# Altium project PCIE_X4_X16_ADP_V1.PrjPcb
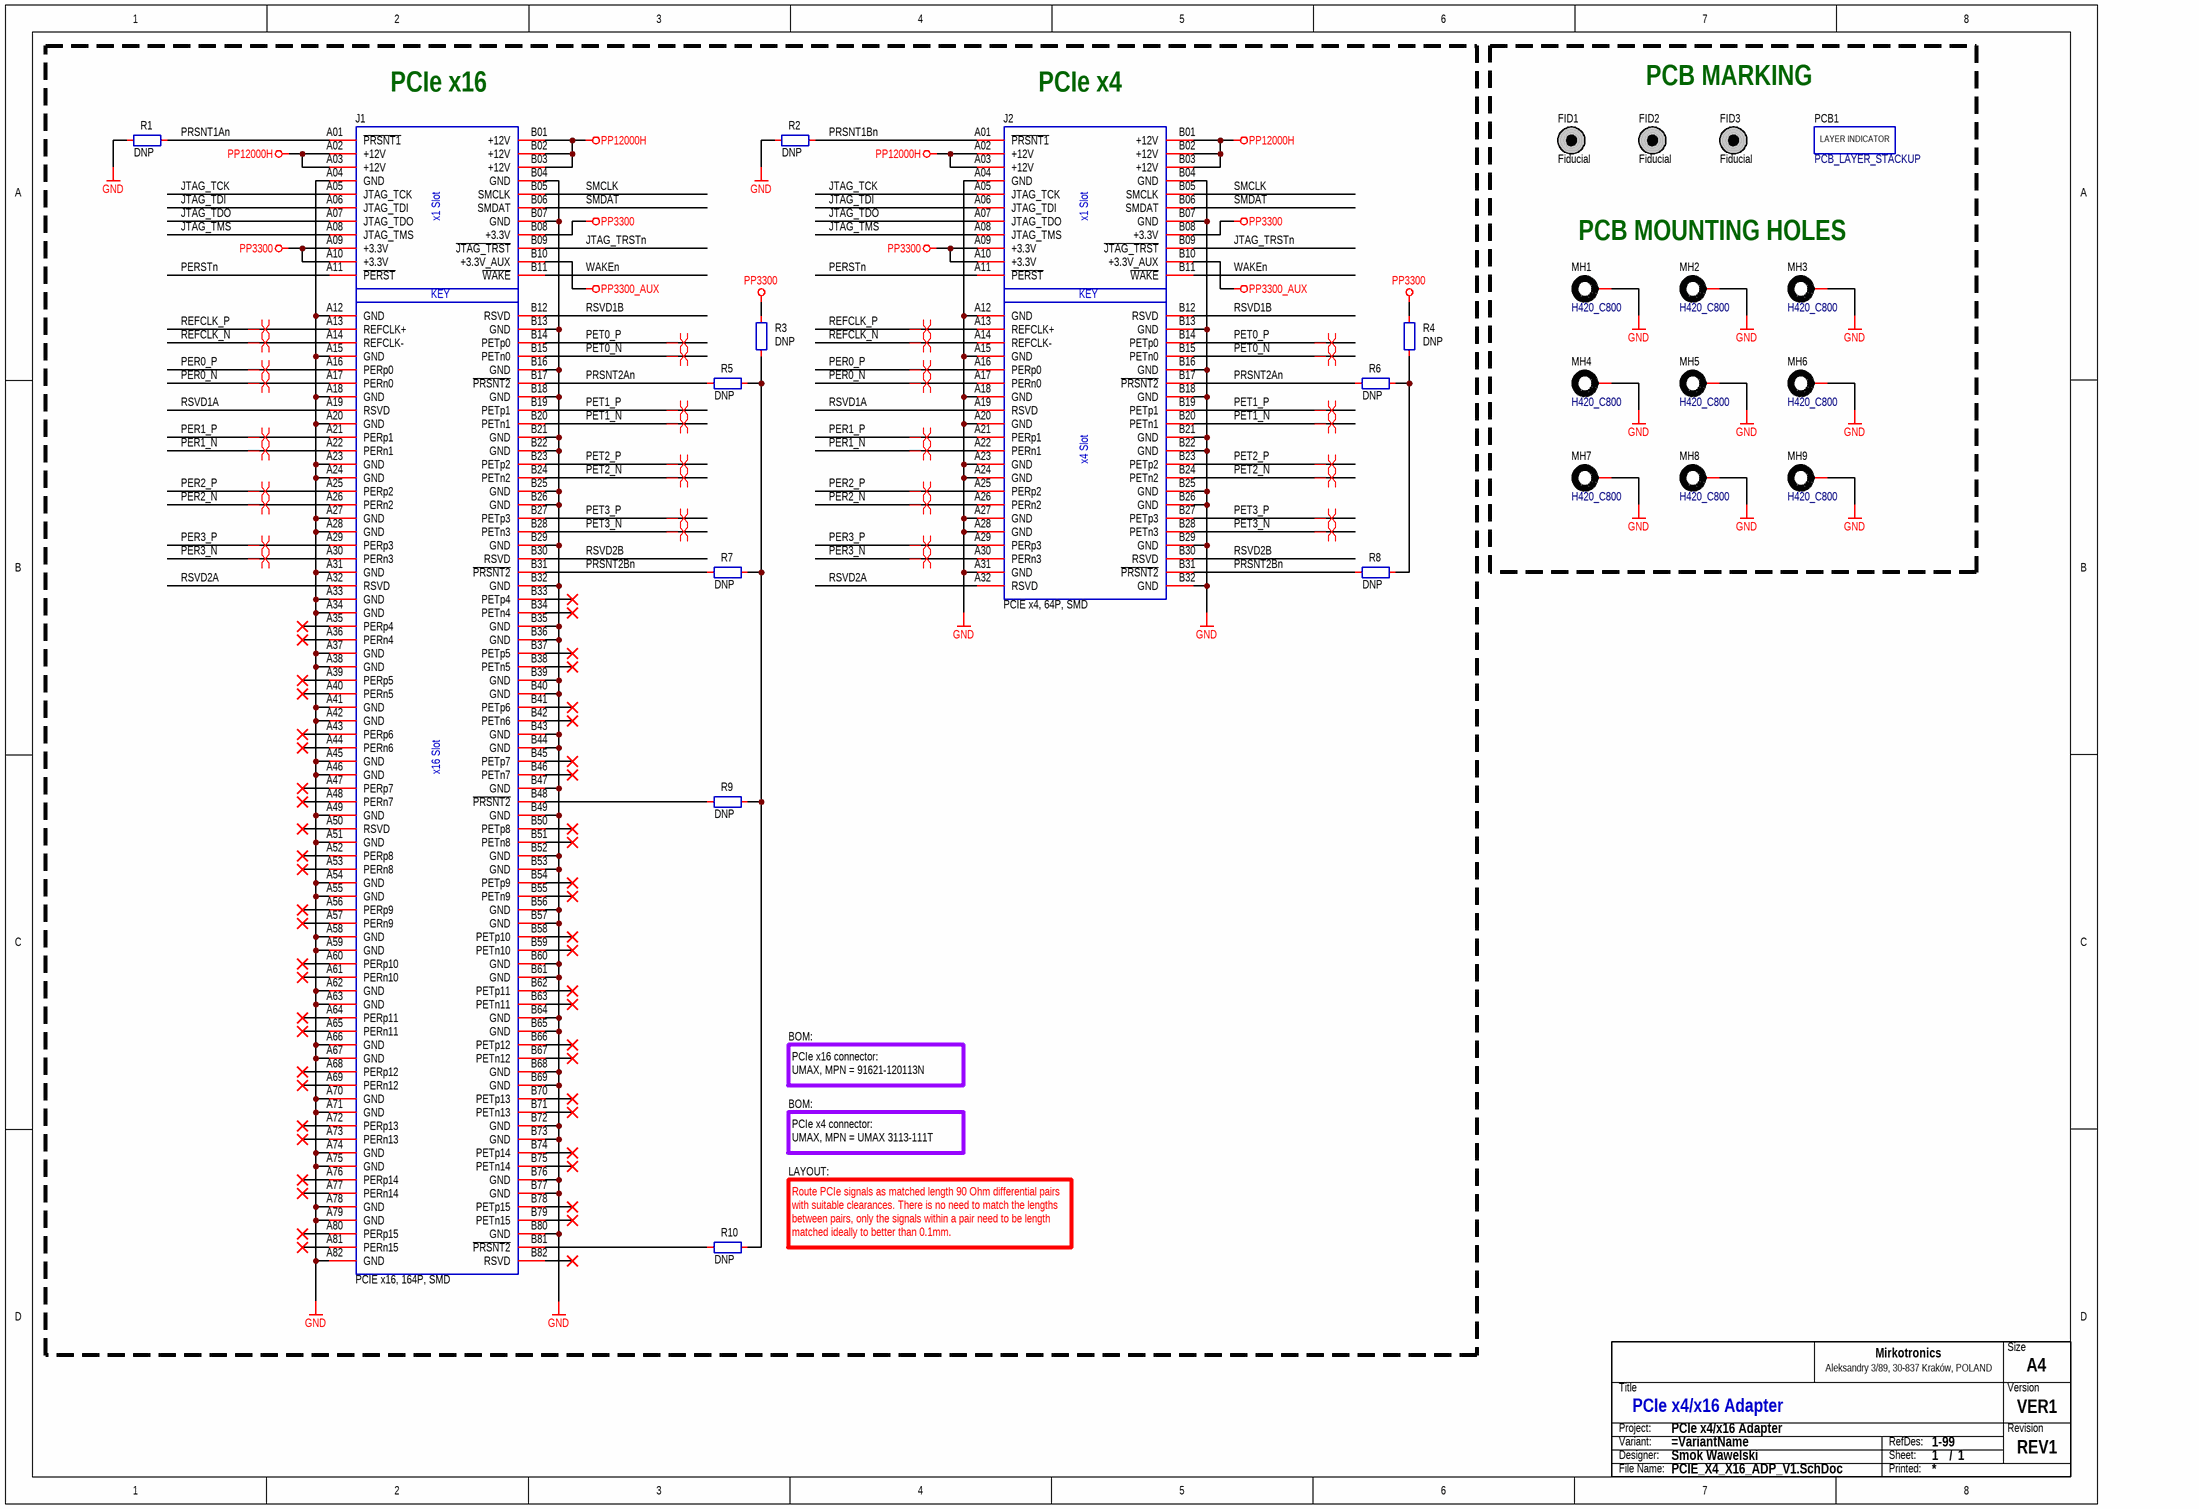
[diagram p0: PCIE_X4_X16_ADP_V1.SchDoc]
GlobalProjectName: PCIe x4/x16 Adapter; PCBProjectName: PCIe x4/x16 Adapter; SchPcbReleaseState: DRAFT; SchPcbRevision: REV1; SchPcbVersion: VER1
1 sheet, 26 parts. Net scope: global (net labels, ports and power ports of the same name join across sheets).
Board file: PCIE_X4_X16_ADP_V1.PcbDoc

## Sheet PCIE_X4_X16_ADP_V1.SchDoc: PCIe x4/x16 Adapter
size A3; Engineer: Smok Wawelski; DocumentNumber: 10; SheetNumber: 1; SheetTotal: 1; PageSize: A4; Designators: 1-99

### Parts
FID1  Fiducial  [PCB_FID_RND_100x300]  (no BOM)
FID2  Fiducial  [PCB_FID_RND_100x300]  (no BOM)
FID3  Fiducial  [PCB_FID_RND_100x300]  (no BOM)
J1  PCIE x16, 164P, SMD  [CON_UMX_91621-120113N]
J2  PCIE x4, 64P, SMD  [CON_UMX_91611-11011T]
MH1  H420_C800  [PCB_MH_H420_C800]  (no BOM)
MH2  H420_C800  [PCB_MH_H420_C800]  (no BOM)
MH3  H420_C800  [PCB_MH_H420_C800]  (no BOM)
MH4  H420_C800  [PCB_MH_H420_C800]  (no BOM)
MH5  H420_C800  [PCB_MH_H420_C800]  (no BOM)
MH6  H420_C800  [PCB_MH_H420_C800]  (no BOM)
MH7  H420_C800  [PCB_MH_H420_C800]  (no BOM)
MH8  H420_C800  [PCB_MH_H420_C800]  (no BOM)
MH9  H420_C800  [PCB_MH_H420_C800]  (no BOM)
PCB1  PCB_LAYER_STACKUP  [PCB_STACKUP-4L]  (no BOM)
R1  DNP  [RES_0603_R]
R2  DNP  [RES_0603_R]
R3  DNP  [RES_0603_R]
R4  DNP  [RES_0603_R]
R5  DNP  [RES_0603_R]
R6  DNP  [RES_0603_R]
R7  DNP  [RES_0603_R]
R8  DNP  [RES_0603_R]
R9  DNP  [RES_0603_R]
R10  DNP  [RES_0603_R]
TB?  Title block  (value not drawn)  (graphical)

### Nets
GND: J1.A04(GND) J1.A12(GND) J1.A15(GND) J1.A18(GND) J1.A20(GND) J1.A23(GND) J1.A24(GND) J1.A27(GND) J1.A28(GND) J1.A31(GND) J1.A33(GND) J1.A34(GND) J1.A37(GND) J1.A38(GND) J1.A41(GND) J1.A42(GND) J1.A45(GND) J1.A46(GND) J1.A49(GND) J1.A51(GND) J1.A54(GND) J1.A55(GND) J1.A58(GND) J1.A59(GND) J1.A62(GND) J1.A63(GND) J1.A66(GND) J1.A67(GND) J1.A70(GND) J1.A71(GND) J1.A74(GND) J1.A75(GND) J1.A78(GND) J1.A79(GND) J1.A82(GND) J1.B04(GND) J1.B07(GND) J1.B13(GND) J1.B16(GND) J1.B18(GND) J1.B21(GND) J1.B22(GND) J1.B25(GND) J1.B26(GND) J1.B29(GND) J1.B32(GND) J1.B35(GND) J1.B36(GND) J1.B39(GND) J1.B40(GND) J1.B43(GND) J1.B44(GND) J1.B47(GND) J1.B49(GND) J1.B52(GND) J1.B53(GND) J1.B56(GND) J1.B57(GND) J1.B60(GND) J1.B61(GND) J1.B64(GND) J1.B65(GND) J1.B68(GND) J1.B69(GND) J1.B72(GND) J1.B73(GND) J1.B76(GND) J1.B77(GND) J1.B80(GND) J2.A04(GND) J2.A12(GND) J2.A15(GND) J2.A18(GND) J2.A20(GND) J2.A23(GND) J2.A24(GND) J2.A27(GND) J2.A28(GND) J2.A31(GND) J2.B04(GND) J2.B07(GND) J2.B13(GND) J2.B16(GND) J2.B18(GND) J2.B21(GND) J2.B22(GND) J2.B25(GND) J2.B26(GND) J2.B29(GND) J2.B32(GND) MH1.MH MH2.MH MH3.MH MH4.MH MH5.MH MH6.MH MH7.MH MH8.MH MH9.MH R1.1 R2.1
PP3300: J1.A09(+3.3V) J1.A10(+3.3V) J1.B08(+3.3V) J2.A09(+3.3V) J2.A10(+3.3V) J2.B08(+3.3V) R3.2 R4.2
PP3300_AUX: J1.B10(+3.3V_AUX) J2.B10(+3.3V_AUX)
PP12000H: J1.A02(+12V) J1.A03(+12V) J1.B01(+12V) J1.B02(+12V) J1.B03(+12V) J2.A02(+12V) J2.A03(+12V) J2.B01(+12V) J2.B02(+12V) J2.B03(+12V)
JTAG_TCK: J1.A05(JTAG_TCK) J2.A05(JTAG_TCK)
JTAG_TDI: J1.A06(JTAG_TDI) J2.A06(JTAG_TDI)
JTAG_TDO: J1.A07(JTAG_TDO) J2.A07(JTAG_TDO)
JTAG_TMS: J1.A08(JTAG_TMS) J2.A08(JTAG_TMS)
JTAG_TRSTn: J1.B09(~{JTAG_T}~{RST}) J2.B09(~{JTAG_T}~{RST})
PER0_N: J1.A17(PERn0) J2.A17(PERn0)
PER0_P: J1.A16(PERp0) J2.A16(PERp0)
PER1_N: J1.A22(PERn1) J2.A22(PERn1)
PER1_P: J1.A21(PERp1) J2.A21(PERp1)
PER2_N: J1.A26(PERn2) J2.A26(PERn2)
PER2_P: J1.A25(PERp2) J2.A25(PERp2)
PER3_N: J1.A30(PERn3) J2.A30(PERn3)
PER3_P: J1.A29(PERp3) J2.A29(PERp3)
PERSTn: J1.A11(~{PERST}) J2.A11(~{PERST})
PET0_N: J1.B15(PETn0) J2.B15(PETn0)
PET0_P: J1.B14(PETp0) J2.B14(PETp0)
PET1_N: J1.B20(PETn1) J2.B20(PETn1)
PET1_P: J1.B19(PETp1) J2.B19(PETp1)
PET2_N: J1.B24(PETn2) J2.B24(PETn2)
PET2_P: J1.B23(PETp2) J2.B23(PETp2)
PET3_N: J1.B28(PETn3) J2.B28(PETn3)
PET3_P: J1.B27(PETp3) J2.B27(PETp3)
PRSNT1An: J1.A01(~{PRSNT1}) R1.2
PRSNT1Bn: J2.A01(~{PRSNT1}) R2.2
PRSNT2An: J1.B17(~{PRSNT2}) J2.B17(~{PRSNT2}) R5.1 R6.1
PRSNT2Bn: J1.B31(~{PRSNT2}) J2.B31(~{PRSNT2}) R7.1 R8.1
REFCLK_N: J1.A14(REFCLK-) J2.A14(REFCLK-)
REFCLK_P: J1.A13(REFCLK+) J2.A13(REFCLK+)
RSVD1A: J1.A19(RSVD) J2.A19(RSVD)
RSVD1B: J1.B12(RSVD) J2.B12(RSVD)
RSVD2A: J1.A32(RSVD) J2.A32(RSVD)
RSVD2B: J1.B30(RSVD) J2.B30(RSVD)
SMCLK: J1.B05(SMCLK) J2.B05(SMCLK)
SMDAT: J1.B06(SMDAT) J2.B06(SMDAT)
WAKEn: J1.B11(~{WAKE}) J2.B11(~{WAKE})
NetJ1_B48: J1.B48(~{PRSNT2}) R9.1
NetJ1_B81: J1.B81(~{PRSNT2}) R10.1
NetR3_1: R3.1 R5.2 R7.2 R9.2 R10.2
NetR4_1: R4.1 R6.2 R8.2

Not connected (* = marked no-connect by the designer): J1 A35(PERp4)* A36(PERn4)* A39(PERp5)* A40(PERn5)* A43(PERp6)* A44(PERn6)* A47(PERp7)* A48(PERn7)* A50(RSVD)* A52(PERp8)* A53(PERn8)* A56(PERp9)* A57(PERn9)* A60(PERp10)* A61(PERn10)* A64(PERp11)* A65(PERn11)* A68(PERp12)* A69(PERn12)* A72(PERp13)* A73(PERn13)* A76(PERp14)* A77(PERn14)* A80(PERp15)* A81(PERn15)* B33(PETp4)* B34(PETn4)* B37(PETp5)* B38(PETn5)* B41(PETp6)* B42(PETn6)* B45(PETp7)* B46(PETn7)* B50(PETp8)* B51(PETn8)* B54(PETp9)* B55(PETn9)* B58(PETp10)* B59(PETn10)* B62(PETp11)* B63(PETn11)* B66(PETp12)* B67(PETn12)* B70(PETp13)* B71(PETn13)* B74(PETp14)* B75(PETn14)* B78(PETp15)* B79(PETn15)* B82(RSVD)*

### Layout directives
differential pair: PER0_N, PER0_P, PER1_N, PER1_P, PER2_N, PER2_P, PER3_N, PER3_P, PET0_N, PET0_P, PET1_N, PET1_P, PET2_N, PET2_P, PET3_N, PET3_P, REFCLK_N, REFCLK_P

### Notes on the sheet
- (near J1) PCIe x16
- (near J2) PCIe x4
- PCB MARKING
- PCB MOUNTING HOLES
- BOM:
- PCIe x16 connector:
  UMAX, MPN = 91621-120113N
- LAYOUT:
- PCIe x4 connector:
  UMAX, MPN = UMAX 3113-111T
- (near R10) Route PCIe signals as matched length 90 Ohm differential pairs with suitable clearances. There is no need to match the lengths between pairs, only the signals within a pair need to be length matched ideally to better than 0.1mm.
- (in symbol CON_PCIE_X4_64P_A2) x1 Slot; KEY; x4 Slot
- (in symbol CON_PCIE_X16_164P_A2) x1 Slot; KEY; x16 Slot
- (in symbol PCB_LAYER_STACKUP) LAYER INDICATOR
- (in symbol SCH_TITLE_BLOCK_MIRKOTRONICS_V2) Size; Mirkotronics; Aleksandry 3/89, 30-837 Kraków, POLAND; Title; Version; Project:; Revision; Variant:; RefDes:; Designer:; Sheet:; /; File Name:; Printed:

### Library data of the parts
FID1-FID3 = PCB_FID_RND: PCB Marking; Fiducial; Round;; Value: Fiducial; Component Subtype: -; Component Type: Fiducial; Mounting Type: -; Supplier: ?
J1 = CON_PCIE_X16_164P_A2: Connector; PCIE x16 (164 pin); Manufacturer: UMAX; MPN: 91621-120113N; Value: PCIE x16, 164P, SMD
J2 = CON_PCIE_X4_64P_A2: Connector; PCIE x4 (64 pin); Manufacturer: UMAX; MPN: UMAX 3113-111T; Value: PCIE x4, 64P, SMD
MH1-MH9 = PCB_MECH_MH: PCB Marking; Mounting hole;; Component Subtype: -; Component Type: Mounting Hole; Mounting Type: -; Supplier: ?; Value: H420_C800
R1-R10 = RES-0051: Resistor; Thick Film; DNP; TBD; TBD; TBD; TBD; DO NOT PLACE; SMD; 0603 (1608);; Component Body: 1.60 x 0.80mm; ID: RES-0051; Component Type: Resistor; Component Subtype: Thick Film; Value: DNP; Manufacturer: TBD; MPN: TBD; Mounting Type: SMD; Package (Case): 0603 (1608); Component Height: TBD; Packaging Type: TBD; ROHS Status: TBD; Operating Temperature: TBD; Resistance: DNP; Tolerance: TBD; Power Rating: TBD; TCR: TBD; Voltage Rating: TBD; Features: DO NOT PLACE
TB? = SCH_TITLE_BLOCK_MIRKOTRONICS_V2: Component Type: Title block; Manufacturer: -; Mounting Type: Non component; MPN: -; Operating Temperature: -; Package: -; Specification: Title block; Value: Title block; Replacement: -; System: ?
PCB1 = PCB_LAYER_STACKUP: Component Subtype: -; Component Type: PCB Marking; Mounting Type: -; Supplier: ?

## Assembly variants
STD: not fitted R1 R2 R3 R4 R5 R6 R7 R8 R9 R10